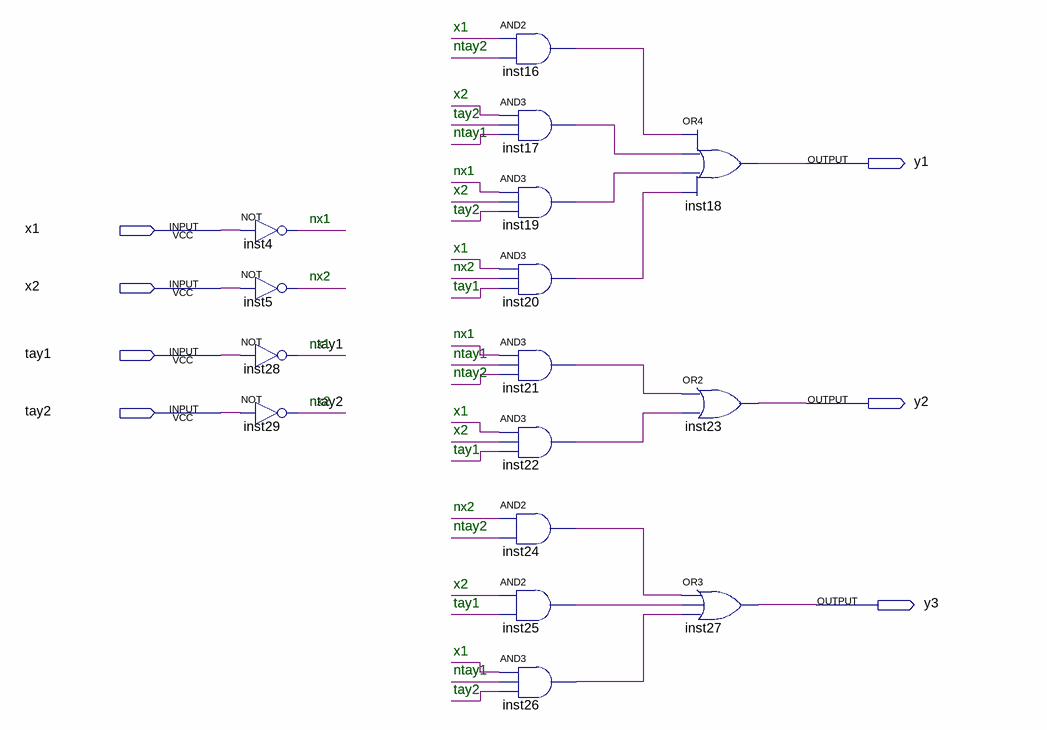
[diagram p0: schematic sheet]
// Quartus schematic mealy_output_scheme.bdf as structural Verilog: 16 symbols, 7 pins
module mealy_output_scheme (
  input  x1,
  input  x2,
  input  tay1,
  input  tay2,
  output y1,
  output y2,
  output y3
);

  wire inst16_out, inst17_out, inst19_out, inst20_out, inst21_out, inst22_out, inst24_out, inst25_out,
       inst26_out, ntay1, ntay2, nx1, nx2;

  not inst4 (nx1, x1);
  not inst5 (nx2, x2);
  not inst28 (ntay1, tay1);
  not inst29 (ntay2, tay2);
  and inst16 (inst16_out, x1, ntay2);
  and inst17 (inst17_out, x2, tay2, ntay1);
  and inst19 (inst19_out, nx1, x2, tay2);
  and inst20 (inst20_out, x1, nx2, tay1);
  and inst21 (inst21_out, nx1, ntay1, ntay2);
  and inst22 (inst22_out, x1, x2, tay1);
  and inst24 (inst24_out, nx2, ntay2);
  and inst25 (inst25_out, x2, tay1);
  and inst26 (inst26_out, x1, ntay1, tay2);
  or inst18 (y1, inst16_out, inst17_out, inst19_out, inst20_out);
  or inst23 (y2, inst21_out, inst22_out);
  or inst27 (y3, inst24_out, inst25_out, inst26_out);

  // Notes on the sheet:
  //   x1
  //   ntay2
  //   x2
  //   tay2
  //   ntay1
  //   nx1
  //   x2
  //   tay2
  //   nx1
  //   x1
  //   nx2
  //   nx2
  //   tay1
  //   nx1
  //   nx1
  //   ntay1
  //   ntay2
  //   nx2
  //   x1
  //   x2
  //   tay1
  //   nx2
  //   ntay2
  //   x2
  //   tay1
  //   x1
  //   ntay1
  //   tay2
endmodule
